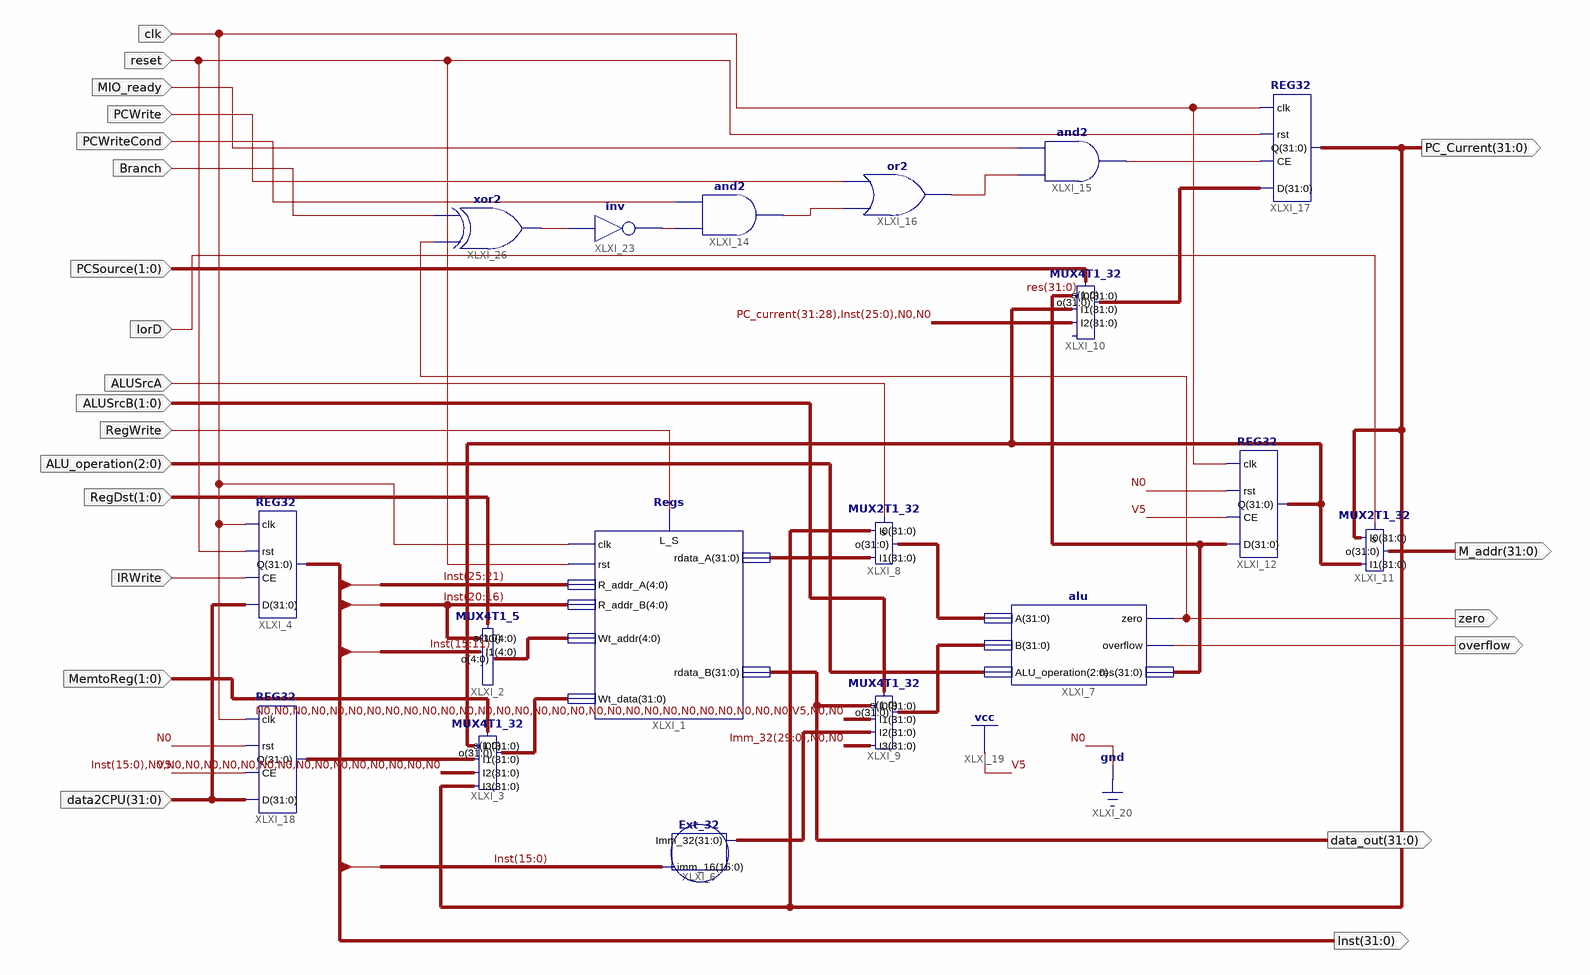
[diagram p0: schematic sheet 1]
// Xilinx ISE schematic MDPath.sch (kintex7) as structural Verilog: 18 symbols, 22 ports
module MDPath (
  input  clk,
  input  reset,
  input  MIO_ready,
  input  PCWrite,
  input  PCWriteCond,
  input  Branch,
  input  IRWrite,
  input  [31:0] data2CPU,
  input  RegWrite,
  input  [1:0] RegDst,
  input  [1:0] MemtoReg,
  input  [2:0] ALU_operation,
  input  [1:0] PCSource,
  input  ALUSrcA,
  input  [1:0] ALUSrcB,
  input  IorD,
  output [31:0] PC_Current,
  output [31:0] Inst,
  output [31:0] M_addr,
  output [31:0] data_out,
  output zero,
  output overflow
);

  wire XLXN_16, XLXN_18, XLXN_25, XLXN_75, XLXN_78;
  wire [4:0] XLXN_35;
  wire [31:0] Imm_32, res, XLXN_36, XLXN_41, XLXN_42, XLXN_54, XLXN_55, XLXN_57, XLXN_68;

  Regs XLXI_1 (
    .clk(clk), .L_S(RegWrite), .rdata_A(XLXN_55), .rst(reset), .Wt_data(XLXN_36), .rdata_B(data_out),
    .R_addr_A(Inst[25:21]), .R_addr_B(Inst[20:16]), .Wt_addr(XLXN_35));
  MUX4T1_5 XLXI_2 (.s(RegDst), .I1(Inst[15:11]), .I0(Inst[20:16]), .o(XLXN_35));  // open: I2, I3
  MUX4T1_32 XLXI_3 (
    .s(MemtoReg), .I0(XLXN_42), .I1(XLXN_41), .I2({Inst[15:0], {16{1'b0}}}), .I3(PC_Current), .o(XLXN_36));
  REG32 XLXI_4 (.D(data2CPU), .CE(IRWrite), .rst(reset), .clk(clk), .Q(Inst));
  Ext_32 XLXI_6 (.imm_16(Inst[15:0]), .Imm_32(Imm_32));
  alu XLXI_7 (.A(XLXN_57), .B(XLXN_54), .ALU_operation(ALU_operation), .zero(zero), .overflow(overflow), .res(res));
  MUX2T1_32 XLXI_8 (.s(ALUSrcA), .I0(PC_Current), .I1(XLXN_55), .o(XLXN_57));
  MUX4T1_32 XLXI_9 (
    .s(ALUSrcB), .I0(data_out), .I1(32'b00000000000000000000000000000100), .I2(Imm_32),
    .I3({Imm_32[29:0], 2'b00}), .o(XLXN_54));
  MUX4T1_32 XLXI_10 (
    .s(PCSource), .I0(res), .I1(XLXN_42), .I2({PC_Current[31:28], Inst[25:0], 2'b00}), .o(XLXN_68));  // open: I3
  MUX2T1_32 XLXI_11 (.s(IorD), .I0(PC_Current), .I1(XLXN_42), .o(M_addr));
  REG32 XLXI_12 (.D(res), .CE(1'b1), .rst(1'b0), .clk(clk), .Q(XLXN_42));
  and XLXI_14 (XLXN_18, XLXN_75, PCWriteCond);
  and XLXI_15 (XLXN_25, XLXN_16, MIO_ready);
  or XLXI_16 (XLXN_16, XLXN_18, PCWrite);
  REG32 XLXI_17 (.D(XLXN_68), .CE(XLXN_25), .rst(reset), .clk(clk), .Q(PC_Current));
  REG32 XLXI_18 (.D(data2CPU), .CE(1'b1), .rst(1'b0), .clk(clk), .Q(XLXN_41));
  not XLXI_23 (XLXN_75, XLXN_78);
  xor XLXI_26 (XLXN_78, zero, Branch);
endmodule
